# EAGLE design Automatic Changeover (EAGLE 9.6.2)
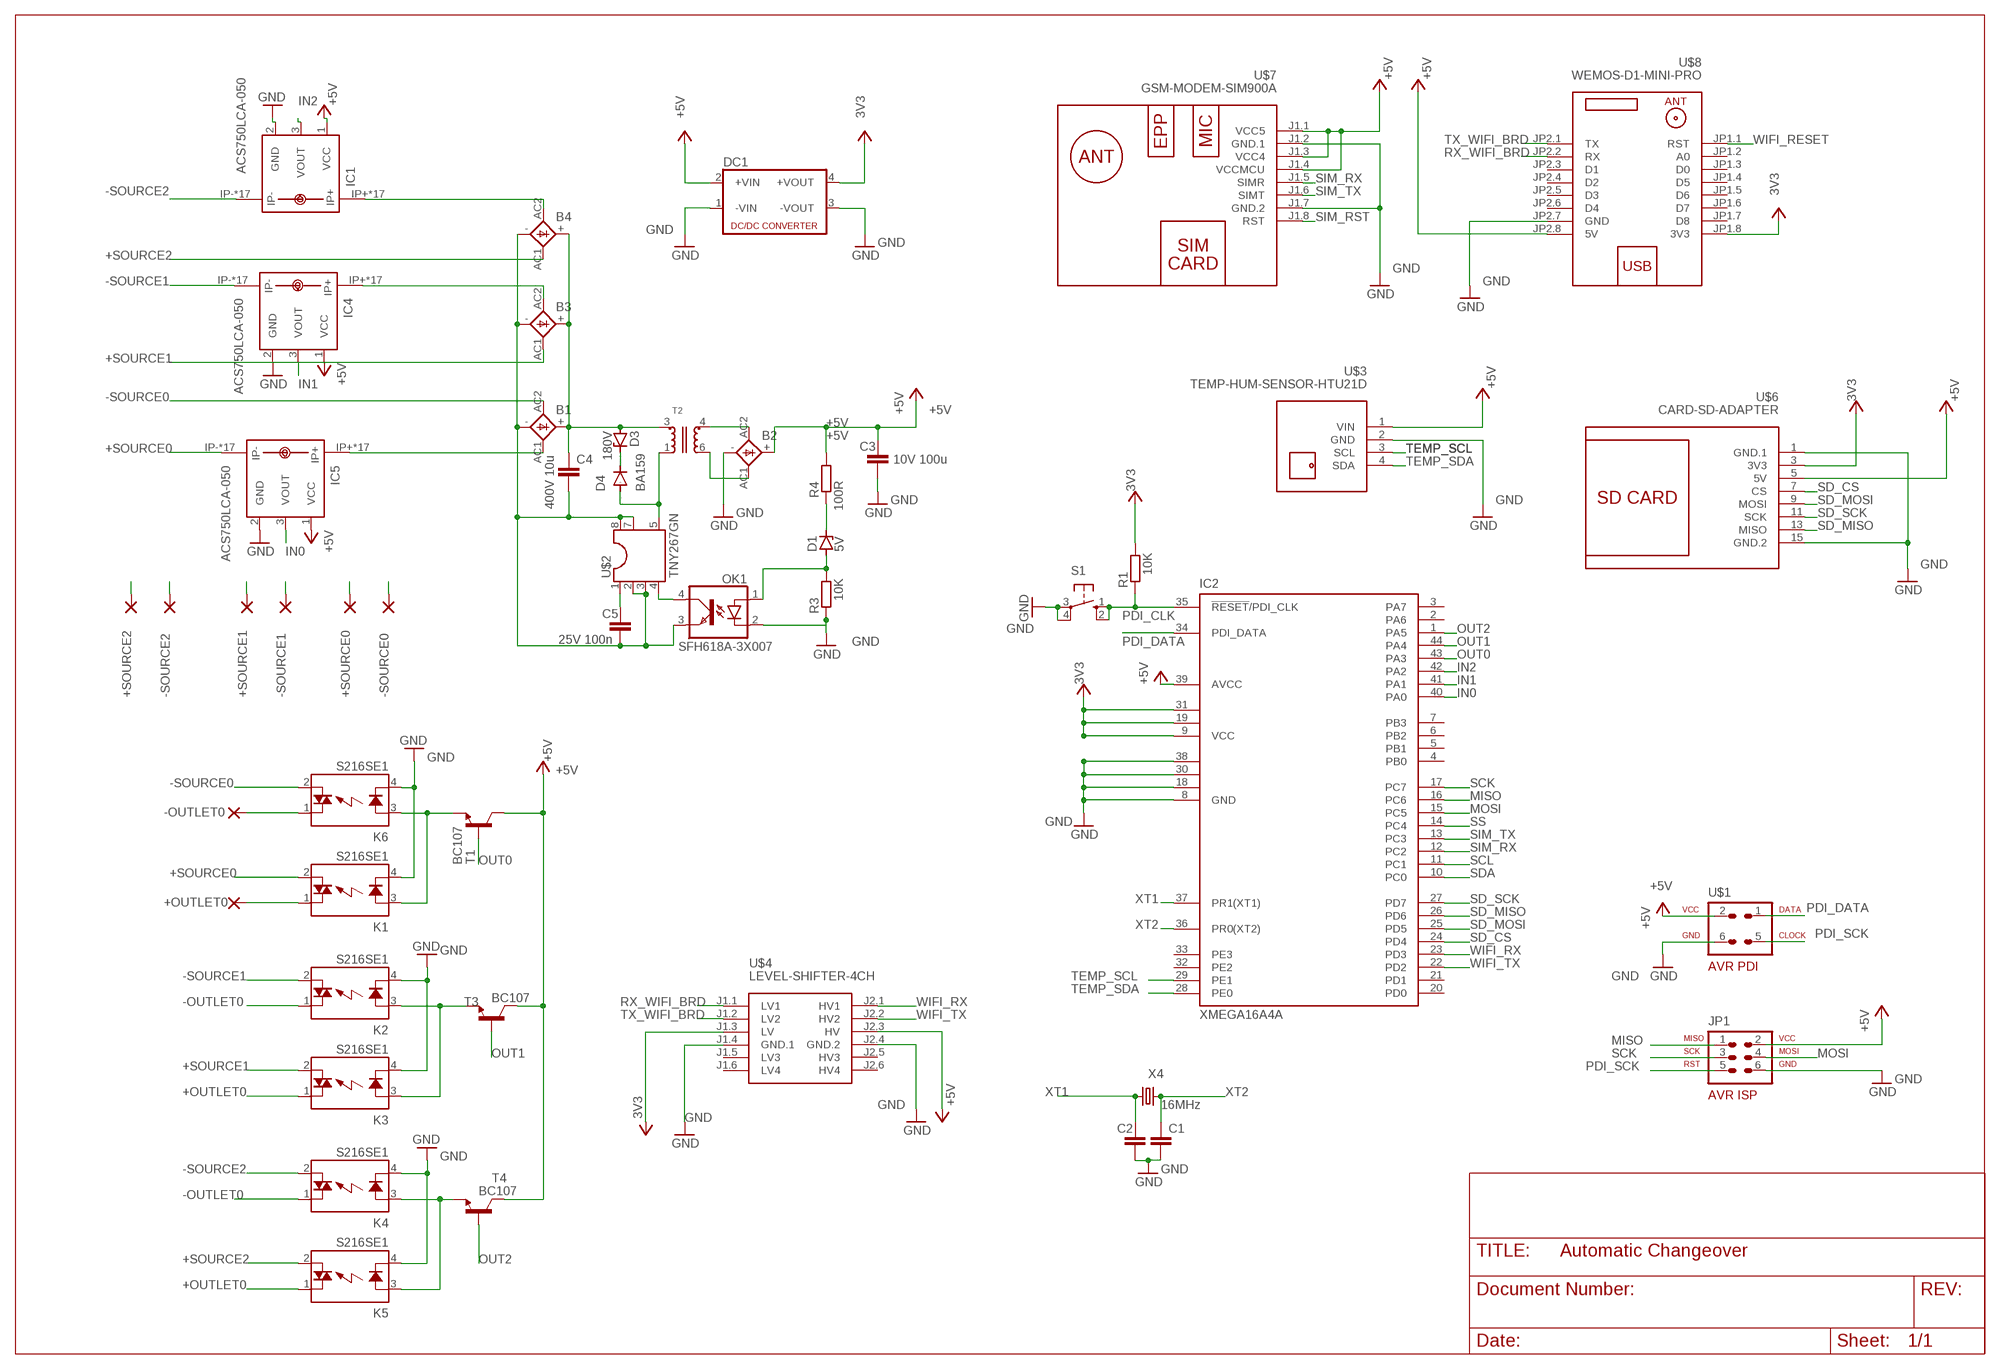
[diagram p0: schematic, sheet 1]

## Parts
+OUTLET0  3,81/1,4  [3,81/1,4]
+SOURCE0  3,81/1,4  [3,81/1,4]
+SOURCE1  3,81/1,4  [3,81/1,4]
+SOURCE2  3,81/1,4  [3,81/1,4]
-OUTLET0  3,81/1,4  [3,81/1,4]
-SOURCE0  3,81/1,4  [3,81/1,4]
-SOURCE1  3,81/1,4  [3,81/1,4]
-SOURCE2  3,81/1,4  [3,81/1,4]
B1  KBL  [KBL]
B2  KBL  [KBL]
B3  KBL  [KBL]
B4  KBL  [KBL]
C1  C-EU025-025X050  [C025-025X050]
C2  C-EU025-025X050  [C025-025X050]
C3  10V 100u  C2.5/2  [C2.5-2]
C4  400V 10u  C2.5/2  [C2.5-2]
C5  25V 100n  C2.5/2  [C2.5-2]
D1  5V  ZENER-DIODEP1-Z12  [P1Z12]
D3  180V  ZENER-DIODEP1-Z12  [P1Z12]
D4  BA159  1N4004  [DO41-10]
DC1  NME  [NME]
IC1  ACS750LCA-050  [ACS75050]
IC2  XMEGA16A4A  [TQFP44]
IC4  ACS750LCA-050  [ACS75050]
IC5  ACS750LCA-050  [ACS75050]
JP1  AVR-ISP-6VERT  [AVR-ISP-6]
K1  S216SE1  [S2XXEX]
K2  S216SE1  [S2XXEX]
K3  S216SE1  [S2XXEX]
K4  S216SE1  [S2XXEX]
K5  S216SE1  [S2XXEX]
K6  S216SE1  [S2XXEX]
OK1  SFH618A-3X007  [SMD4-7]
R1  10K  R-EU_R0805  [R0805]
R3  10K  R-EU_R0805  [R0805]
R4  100R  R-EU_R0805  [R0805]
S1  10-XX  [B3F-10XX]
T1  BC107  [TO18]
T2  WE-UNIT_74911810X  [WE_E13/7/4_THT_VERTIKAL_6PIN]
T3  BC107  [TO18]
T4  BC107  [TO18]
U$1  AVR-PDIVERT  [AVR-ISP-6]
U$2  TNY267GN  [SMD-8B]
U$3  TEMP-HUM-SENSOR-HTU21D  [TEMP-HUM-SENSOR-HTU21D]
U$4  LEVEL-SHIFTER-4CH  [LEVEL-SHIFTER-4CH]
U$6  CARD-SD-ADAPTER  [CARD-SD-ADAPTER]
U$7  GSM-MODEM-SIM900A  [GSM-MODEM-SIM900A]
U$8  WEMOS-D1-MINI-PRO  [WEMOS-D1-MINI-PRO]
X4  16MHz  CRYSTALS-NOGND-HC49/4H  [HC49]

## Nets
3V3: DC1.4(+VOUT) R1.2 U$6.3(3V3) U$8.JP1.8(3V3)
+5V: B2.+ C3.1 DC1.2(+VIN) IC1.1(VCC) IC2.39(AVCC) IC4.1(VCC) IC5.1(VCC) JP1.2 R4.2 T1.3(C) T3.3(C) T4.3(C) U$1.2 U$3.1(VIN) U$4.J2.3(HV) U$6.5(5V) U$7.J1.1(VCC5) U$7.J1.3(VCC4) U$7.J1.4(VCCMCU) U$8.JP2.8(5V)
+OUTLET0: K3.1(DS1) K5.1(DS1)
+SOURCE0: +SOURCE0.1(P) IC5.IP- IC5.IP-@2(IP-) IC5.IP-@3(IP-) IC5.IP-@4(IP-) IC5.IP-@5(IP-) IC5.IP-@6(IP-) IC5.IP-@7(IP-) IC5.IP-@8(IP-) IC5.IP-@9(IP-) IC5.IP-@10(IP-) IC5.IP-@11(IP-) IC5.IP-@12(IP-) IC5.IP-@13(IP-) IC5.IP-@14(IP-) IC5.IP-@15(IP-) IC5.IP-@16(IP-) IC5.IP-@17(IP-) K1.2(DS2)
+SOURCE1: +SOURCE1.1(P) B3.AC1(AC2) K3.2(DS2)
+SOURCE2: +SOURCE2.1(P) B4.AC1(AC2) K5.2(DS2)
-OUTLET0: K2.1(DS1) K4.1(DS1)
-SOURCE0: -SOURCE0.1(P) B1.AC2(AC1) K6.2(DS2)
-SOURCE1: -SOURCE1.1(P) IC4.IP- IC4.IP-@2(IP-) IC4.IP-@3(IP-) IC4.IP-@4(IP-) IC4.IP-@5(IP-) IC4.IP-@6(IP-) IC4.IP-@7(IP-) IC4.IP-@8(IP-) IC4.IP-@9(IP-) IC4.IP-@10(IP-) IC4.IP-@11(IP-) IC4.IP-@12(IP-) IC4.IP-@13(IP-) IC4.IP-@14(IP-) IC4.IP-@15(IP-) IC4.IP-@16(IP-) IC4.IP-@17(IP-) K2.2(DS2)
-SOURCE2: -SOURCE2.1(P) IC1.IP- IC1.IP-@2(IP-) IC1.IP-@3(IP-) IC1.IP-@4(IP-) IC1.IP-@5(IP-) IC1.IP-@6(IP-) IC1.IP-@7(IP-) IC1.IP-@8(IP-) IC1.IP-@9(IP-) IC1.IP-@10(IP-) IC1.IP-@11(IP-) IC1.IP-@12(IP-) IC1.IP-@13(IP-) IC1.IP-@14(IP-) IC1.IP-@15(IP-) IC1.IP-@16(IP-) IC1.IP-@17(IP-) K4.2(DS2)
GND: B2.- C1.2 C2.2 C3.2 DC1.1(-VIN) DC1.3(-VOUT) IC1.2(GND) IC2.8(GND) IC2.18(GND1) IC2.30(GND2) IC2.38(GND3) IC4.2(GND) IC5.2(GND) JP1.6 K1.4(K) K2.4(K) K3.4(K) K4.4(K) K5.4(K) K6.4(K) OK1.2(C) R3.1 S1.3(P) S1.4(P1) U$1.6 U$3.2(GND) U$4.J1.4(GND.1) U$4.J2.4(GND.2) U$6.1(GND.1) U$6.15(GND.2) U$7.J1.2(GND.1) U$7.J1.7(GND.2) U$8.JP2.7(GND)
IN0: IC2.40(PA0) IC5.3(VOUT)
IN1: IC2.41(PA1) IC4.3(VOUT)
IN2: IC1.3(VOUT) IC2.42(PA2)
MISO: IC2.16(PC6) JP1.1
MOSI: IC2.15(PC5) JP1.4
N$14: B4.AC2(AC1) IC1.IP+ IC1.IP+@2(IP+) IC1.IP+@3(IP+) IC1.IP+@4(IP+) IC1.IP+@5(IP+) IC1.IP+@6(IP+) IC1.IP+@7(IP+) IC1.IP+@8(IP+) IC1.IP+@9(IP+) IC1.IP+@10(IP+) IC1.IP+@11(IP+) IC1.IP+@12(IP+) IC1.IP+@13(IP+) IC1.IP+@14(IP+) IC1.IP+@15(IP+) IC1.IP+@16(IP+) IC1.IP+@17(IP+)
N$16: B1.AC1(AC2) IC5.IP+ IC5.IP+@2(IP+) IC5.IP+@3(IP+) IC5.IP+@4(IP+) IC5.IP+@5(IP+) IC5.IP+@6(IP+) IC5.IP+@7(IP+) IC5.IP+@8(IP+) IC5.IP+@9(IP+) IC5.IP+@10(IP+) IC5.IP+@11(IP+) IC5.IP+@12(IP+) IC5.IP+@13(IP+) IC5.IP+@14(IP+) IC5.IP+@15(IP+) IC5.IP+@16(IP+) IC5.IP+@17(IP+)
N$17: B1.+ B3.+ B4.+ C4.1 D3.A T2.3
N$20: B3.AC2(AC1) IC4.IP+ IC4.IP+@2(IP+) IC4.IP+@3(IP+) IC4.IP+@4(IP+) IC4.IP+@5(IP+) IC4.IP+@6(IP+) IC4.IP+@7(IP+) IC4.IP+@8(IP+) IC4.IP+@9(IP+) IC4.IP+@10(IP+) IC4.IP+@11(IP+) IC4.IP+@12(IP+) IC4.IP+@13(IP+) IC4.IP+@14(IP+) IC4.IP+@15(IP+) IC4.IP+@16(IP+) IC4.IP+@17(IP+)
N$32: -OUTLET0.1(P) K6.1(DS1)
N$36: D4.A T2.1 U$2.5(D)
N$38: B2.AC1(AC2) T2.6
N$39: D1.C R4.1
N$40: D1.A OK1.1(A) R3.2
N$41: B1.- B3.- B4.- C4.2 C5.2 OK1.3(EMIT) U$2.2(2GND) U$2.3(3GND) U$2.7(7HV-GND) U$2.8(8HV-GND)
N$42: B2.AC2(AC1) T2.4
N$43: D3.C D4.C
N$44: C5.1 U$2.1(BP)
N$45: OK1.4(COL) U$2.4(EN/UV)
N$47: +OUTLET0.1(P) K1.1(DS1)
N$58: K1.3(A) K6.3(A) T1.1(E)
N$61: K2.3(A) K3.3(A) T3.1(E)
N$63: K4.3(A) K5.3(A) T4.1(E)
OUT0: IC2.43(PA3) T1.2(B)
OUT1: IC2.44(PA4) T3.2(B)
OUT2: IC2.1(PA5) T4.2(B)
PDI_CLK: IC2.35(!RESET!/PDI_CLK) R1.1 S1.1(S) S1.2(S1)
PDI_DATA: IC2.34(PDI_DATA) U$1.1
PDI_SCK: JP1.5 U$1.5
RX_WIFI_BRD: U$4.J1.1(LV1) U$8.JP2.2(RX)
SCK: IC2.17(PC7) JP1.3
SCL: IC2.11(PC1)
SD_CS: IC2.24(PD4) U$6.7(CS)
SD_MISO: IC2.26(PD6) U$6.13(MISO)
SD_MOSI: IC2.25(PD5) U$6.9(MOSI)
SD_SCK: IC2.27(PD7) U$6.11(SCK)
SDA: IC2.10(PC0)
SIM_RST: U$7.J1.8(RST)
SIM_RX: IC2.12(PC2) U$7.J1.5(SIMR)
SIM_TX: IC2.13(PC3) U$7.J1.6(SIMT)
SS: IC2.14(PC4)
TEMP_SCL: IC2.29(PE1) U$3.3(SCL)
TEMP_SDA: IC2.28(PE0) U$3.4(SDA)
TX_WIFI_BRD: U$4.J1.2(LV2) U$8.JP2.1(TX)
VCC: IC2.9(VCC) IC2.19(VCC1) IC2.31(VCC2) U$4.J1.3(LV) ; supply symbol labelled 3V3
WIFI_RESET: U$8.JP1.1(RST)
WIFI_RX: IC2.23(PD3) U$4.J2.1(HV1)
WIFI_TX: IC2.22(PD2) U$4.J2.2(HV2)
XT1: C2.1 IC2.37(PR1(XT1)) X4.1
XT2: C1.1 IC2.36(PR0(XT2)) X4.2
Unconnected: IC2.2(PA6) IC2.3(PA7) IC2.4(PB0) IC2.5(PB1) IC2.6(PB2) IC2.7(PB3) IC2.20(PD0) IC2.21(PD1) IC2.32(PE2) IC2.33(PE3) U$4.J1.5(LV3) U$4.J1.6(LV4) U$4.J2.5(HV3) U$4.J2.6(HV4) U$8.JP1.2(A0) U$8.JP1.3(D0) U$8.JP1.4(D5) U$8.JP1.5(D6) U$8.JP1.6(D7) U$8.JP1.7(D8) U$8.JP2.3(D1) U$8.JP2.4(D2) U$8.JP2.5(D3) U$8.JP2.6(D4)

## Library data of the parts
+OUTLET0 +SOURCE0 +SOURCE1 +SOURCE2 -OUTLET0 -SOURCE0 -SOURCE1 -SOURCE2 = wirepad:3,81/1,4: THROUGH-HOLE PAD
B1-B4 = rectifier:KBL: DIOTEC RECTIFIER
C1 C2 = rcl:C-EU: CAPACITOR, European symbol; SPICEPREFIX: C
C3-C5 = capacitor-wima:C: CAPACITOR naming: grid - package width
D1 D3 = diode:ZENER-DIODE: Z-Diode
D4 = diode:1N4004: DIODE general purpose rectifier, 1 A
DC1 = dc-dc-converter:NME: DC-DC CONVERTER; MF: C & D TECHNOLOGIES, INC; MPN: NME1205D; OC_FARNELL: 1021466; OC_NEWARK: 98B8198
IC1 IC4 IC5 = allegro:ACS750*CA-050: Current Sensor display layer 49 Reference in BRD and place VIAs on circles Source: www.allegromicro.com/datafile/0750-050.pdf; MF: ALLEGRO MICROSYSTEMS, INC.; MPN: ACS750LCA-050; OC_FARNELL: 1457176; OC_NEWARK: 61H4464
IC2 = atmel:XMEGA16A4: MICROCONTROLLER Features High-performance, Low-power 8/16-bit AVR XMEGA Microcontroller Non-Volatile Program and Data Memories - 16 KB - 128 KB of In-System Self-Programmable Flash - 4 KB - 8 KB Boot Code Section with Independent Lock Bits - 1 KB - 2 KB EEPROM - 2 KB - 8 KB Internal SRAM Peripheral Features - Four-channel DMA Controller with support for external requests - Eight-channel Event System - Five 16-bit Timer/Counters Three Timer/Counters with 4 Output Compare or Input Capture channels Two Timer/Counters with 2 Output Compare or Input Capture channels High-Resolution Extensions on all Timer/Counters Advanced Waveform Extension on one Timer/Counter - Five USARTs IrDA Extension on one USART - Two Two-Wire Interfaces with dual address match (I2C and SMBus compatible) - Two SPIs (Serial Peripheral Interfaces) peripherals - AES and DES Crypto Engine - 16-bit Real Time Counter with Separate Oscillator - One Twelve-channel, 12-bit, 2 Msps Analog to Digital Converter - One Two-channel, 12-bit, 1 Msps Digital to Analog Converter - Two Analog Comparators with Window compare function - External Interrupts on all General Purpose I/O pins - Programmable Watchdog Timer with Separate On-chip Ultra Low Power Oscillator Special Microcontroller Features - Power-on Reset and Programmable Brown-out Detection - Internal and External Clock Options with PLL - Programmable Multi-level Interrupt Controller - Sleep Modes: Idle, Power-down, Standby, Power-save, Extended Standby - Advanced Programming, Test and Debugging Interfaces PDI (Program and Debug Interface) for programming, test and debugging I/O and Packages - 34 Programmable I/O Lines - 44 - lead TQFP - 44 - pad VQFN/QFN - 49 - ball VFBGA Operating Voltage - 1.6 - 3.6V Speed performance - 0 - 12 MHz @ 1.6 - 3.6V - 0 - 32 MHz @ 2.7 - 3.6V Drawn by Dipl.-Ing. (FH) Robert Siegler Created: 27.05.09; OC_FARNELL: unknown; OC_NEWARK: unknown
JP1 = avr-7:AVR-ISP-6: AVR ISP-6 Serial Programming Header
K1-K6 = relay:S2*: SIP Type SSR for Medium Power Control SHARP Source: 168149-da-01-en-Solid_State_Relais_S_202_SE1_SE2.pdf; OC_FARNELL: unknown; OC_NEWARK: unknown
OK1 = optocoupler:SFH618?*: Optocoupler, Phototransistor Output, Low Input Current Source: Data sheet <http://www.vishay.com/docs/83673/sfh618.pdf>; OC_FARNELL: unknown; OC_NEWARK: unknown
R1 R3 R4 = rcl:R-EU_: RESISTOR, European symbol; SPICEPREFIX: R
S1 = switch-omron:10-XX: OMRON SWITCH; MPN: B3F-1000; OC_FARNELL: 176432; OC_NEWARK: 36M3542
T1 T3 T4 = transistor:BC107: NPN TRANSISTOR
T2 = Wurth_Elektronik_Passive_rev16b:WE-UNIT_74911810X: WE-UNIT Off-Line Transformer Characteristics Nominal input voltage: 125–375 VDC (85–265 VAC) Output power 3 W and 9 W Operating temperature: –40 °C to +125 °C Clearance and creepage distance 6 mm min. Insulation test voltage: 4 kVAC, 1 Minute Design compliant to EN 61558-2-16: reinforced insulation; except 749 118 10 xx: Basic insulation Applications Designed for Tiny Switch ICs from Power Integration and NCP101x or 105x of ON Semiconductor For SMPS with universal input from 85 VAC up to 265 VAC <http://katalog.we-online.de/media/images/eisos/UtUNIT_MID_pf2.jpg> Details see: http://katalog.we-online.de/en/pbs/WE-UNIT?m Updated by Dan Xu 2014-07-11 2014 (C) Wurth Elektronik
U$1 = avr-7:AVR-PDI: AVR PDI programming interface connector
U$2 = tny26x_27x:TNY267GN
U$3 = diy-modules:TEMP-HUM-SENSOR-HTU21D: Digital Humidity & Temperature Sensor based on HTU21D device More information about HTU21D device is available here: http://futureeverything.org/wp-content/uploads/2014/05/Humidity-Datasheet.pdf HTU21D Arudino Library is available here: https://learn.sparkfun.com/tutorials/htu21d-humidity-sensor-hookup-guide/htu21d-library-and-functions Click here to find device on ebay.com <http://www.ebay.com/sch/htu21d+board>
U$4 = diy-modules:LEVEL-SHIFTER-4CH: 4-Channel Bi-Directional Logic Level Converter based on BSS128 transistors Click here to find device on ebay.com <http://www.ebay.com/sch/i2c+logic+converter+module>
U$6 = diy-modules:CARD-SD-ADAPTER: Full Size SD Card Adapter Module with onboard 3.3V regulator Guide describing how to use SD card with Arduino is available here: https://www.arduino.cc/en/Reference/SDCardNotes Click here to find device on ebay.com <http://www.ebay.com/sch/sd+card+socket+module>
U$7 = diy-modules:GSM-MODEM-SIM900A: GSM Mini Module based on SIM900A Schematic available here: http://www.electrodragon.com/w/SIM900_(SIM900A)_Mini_DEV_Board
U$8 = diy-modules:WEMOS-D1-MINI-PRO: WEMOS D1 mini Pro: Mini Wi-Fi Board based on ESP-8266EX chip More details can be found here: https://www.wemos.cc/product/d1-mini-pro.html Click here to find device on ebay.com <http://www.ebay.com/sch/wemos+d1+mini+pro>
X4 = IQD-Frequency-Products:CRYSTALS-NOGND: CRYSTALS CAN NOT GROUNDED

## Net classes
0 default: width 0.203 mm, drill 0.203 mm, clearance 0.152 mm

## Board
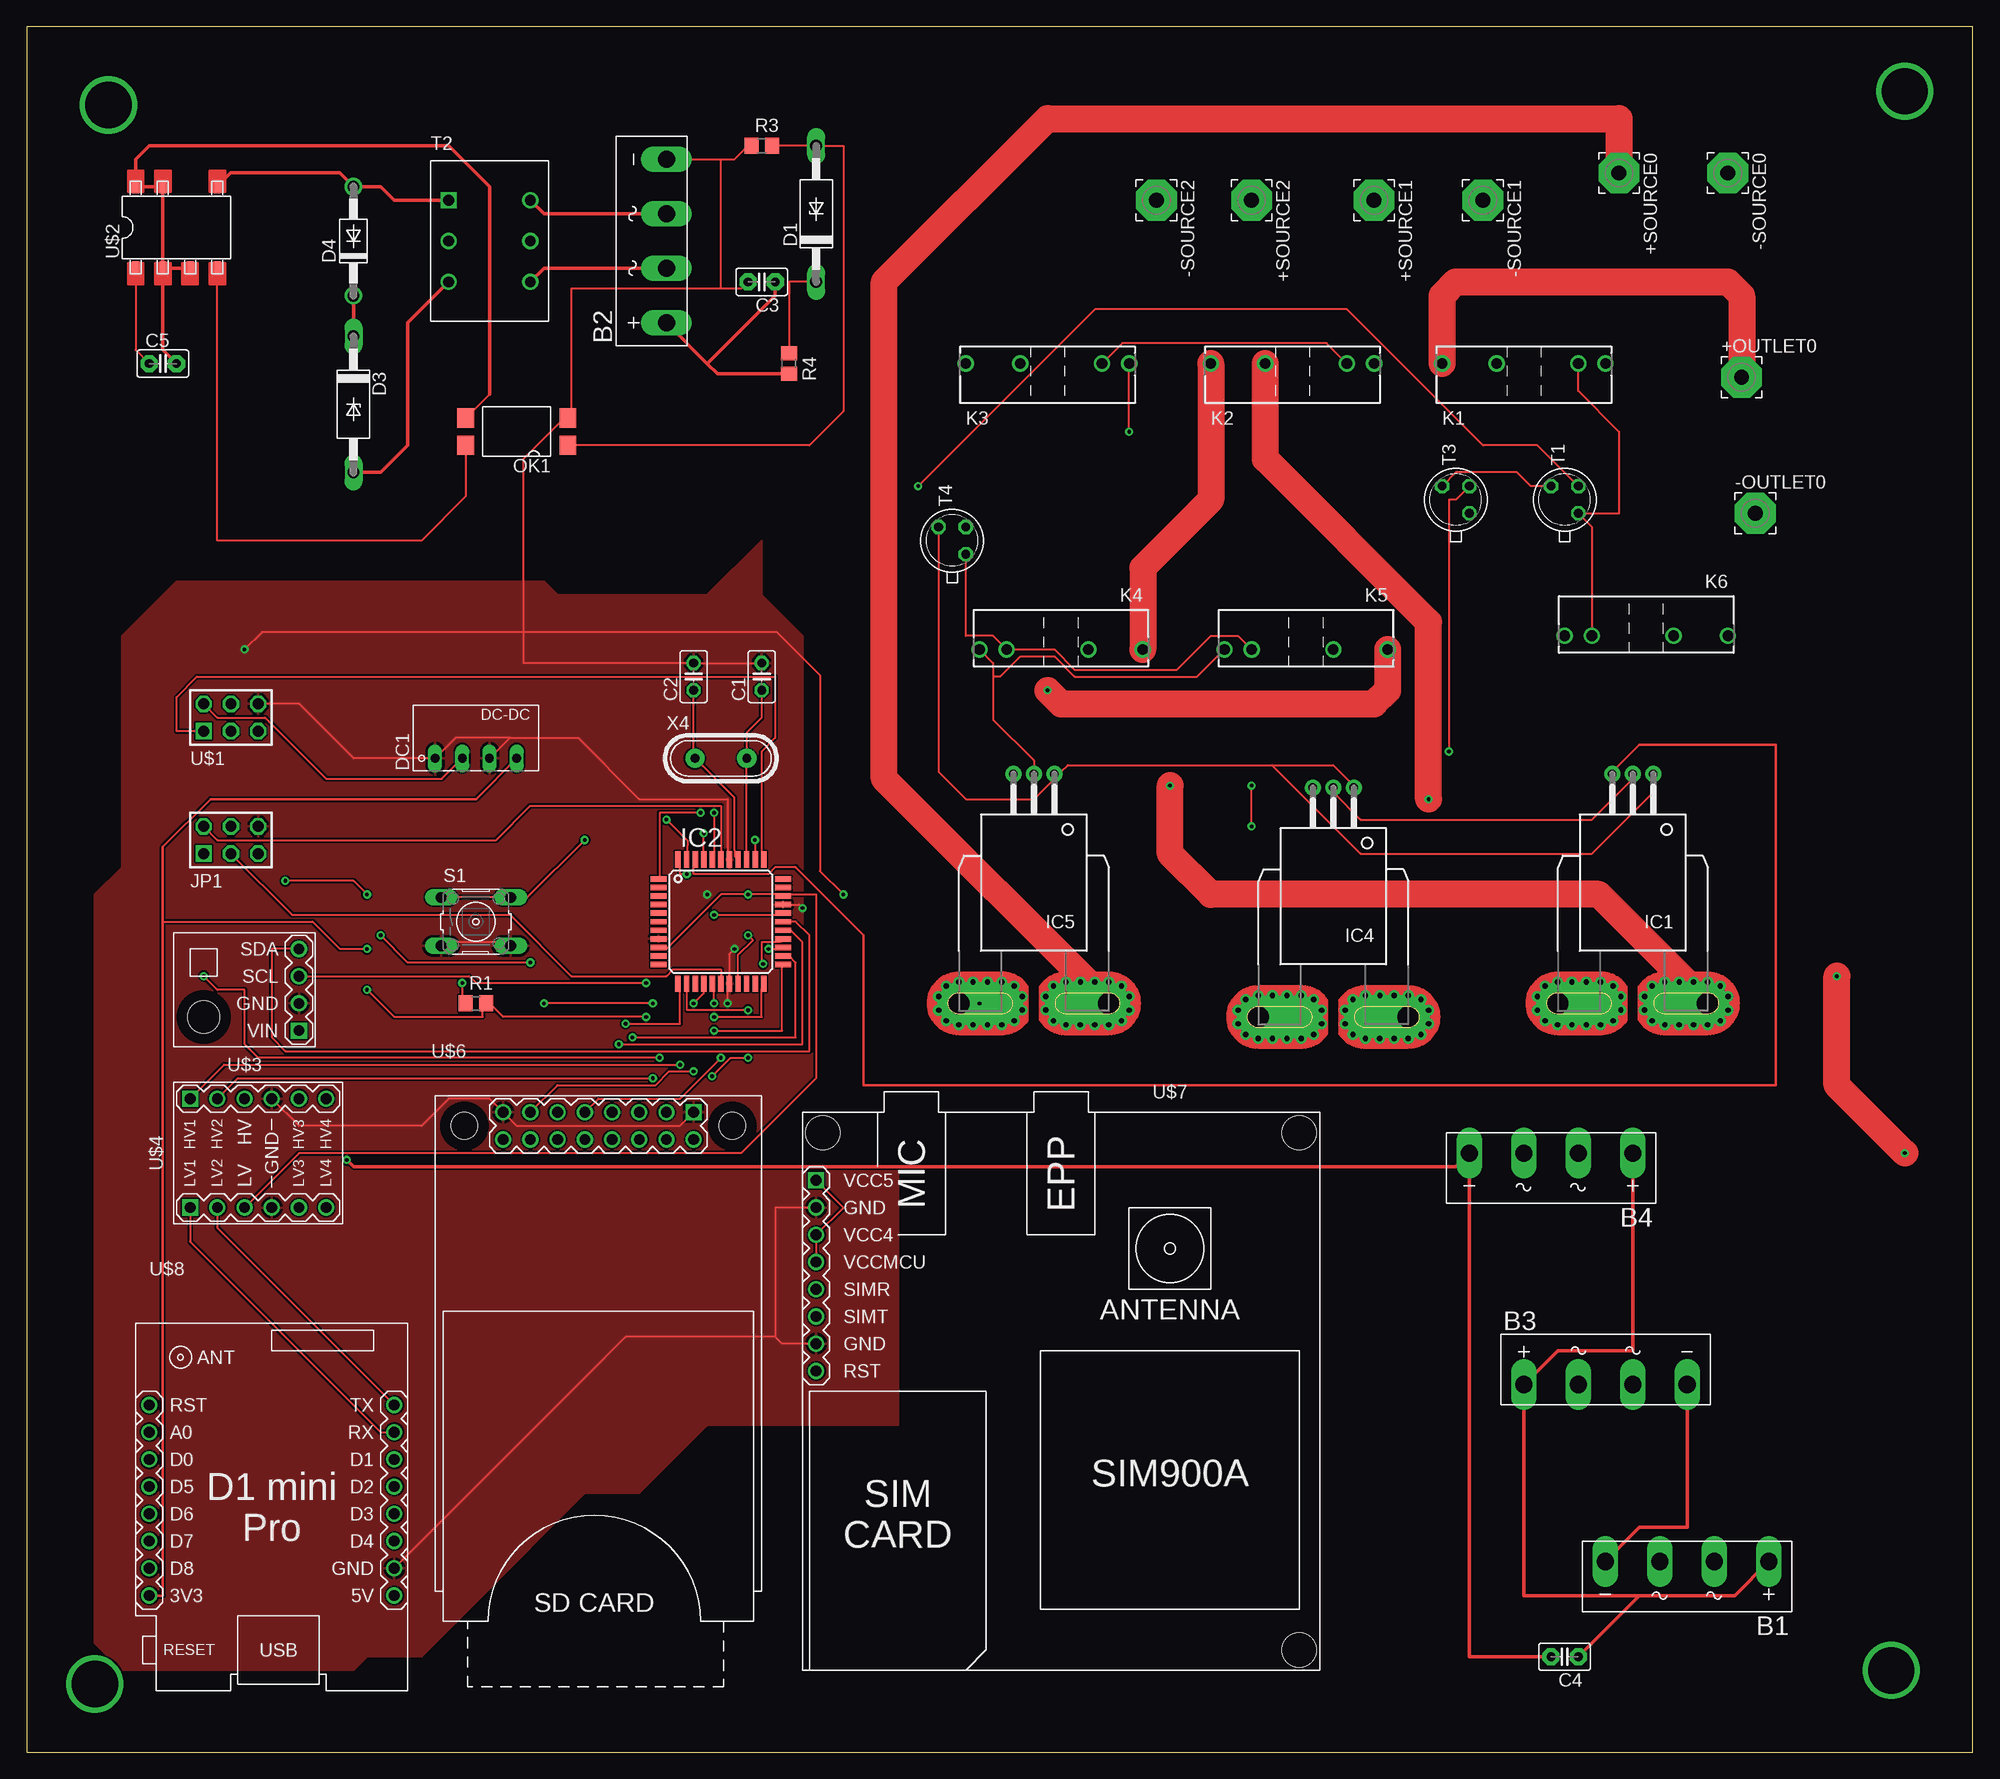
[diagram p1: board, top side]
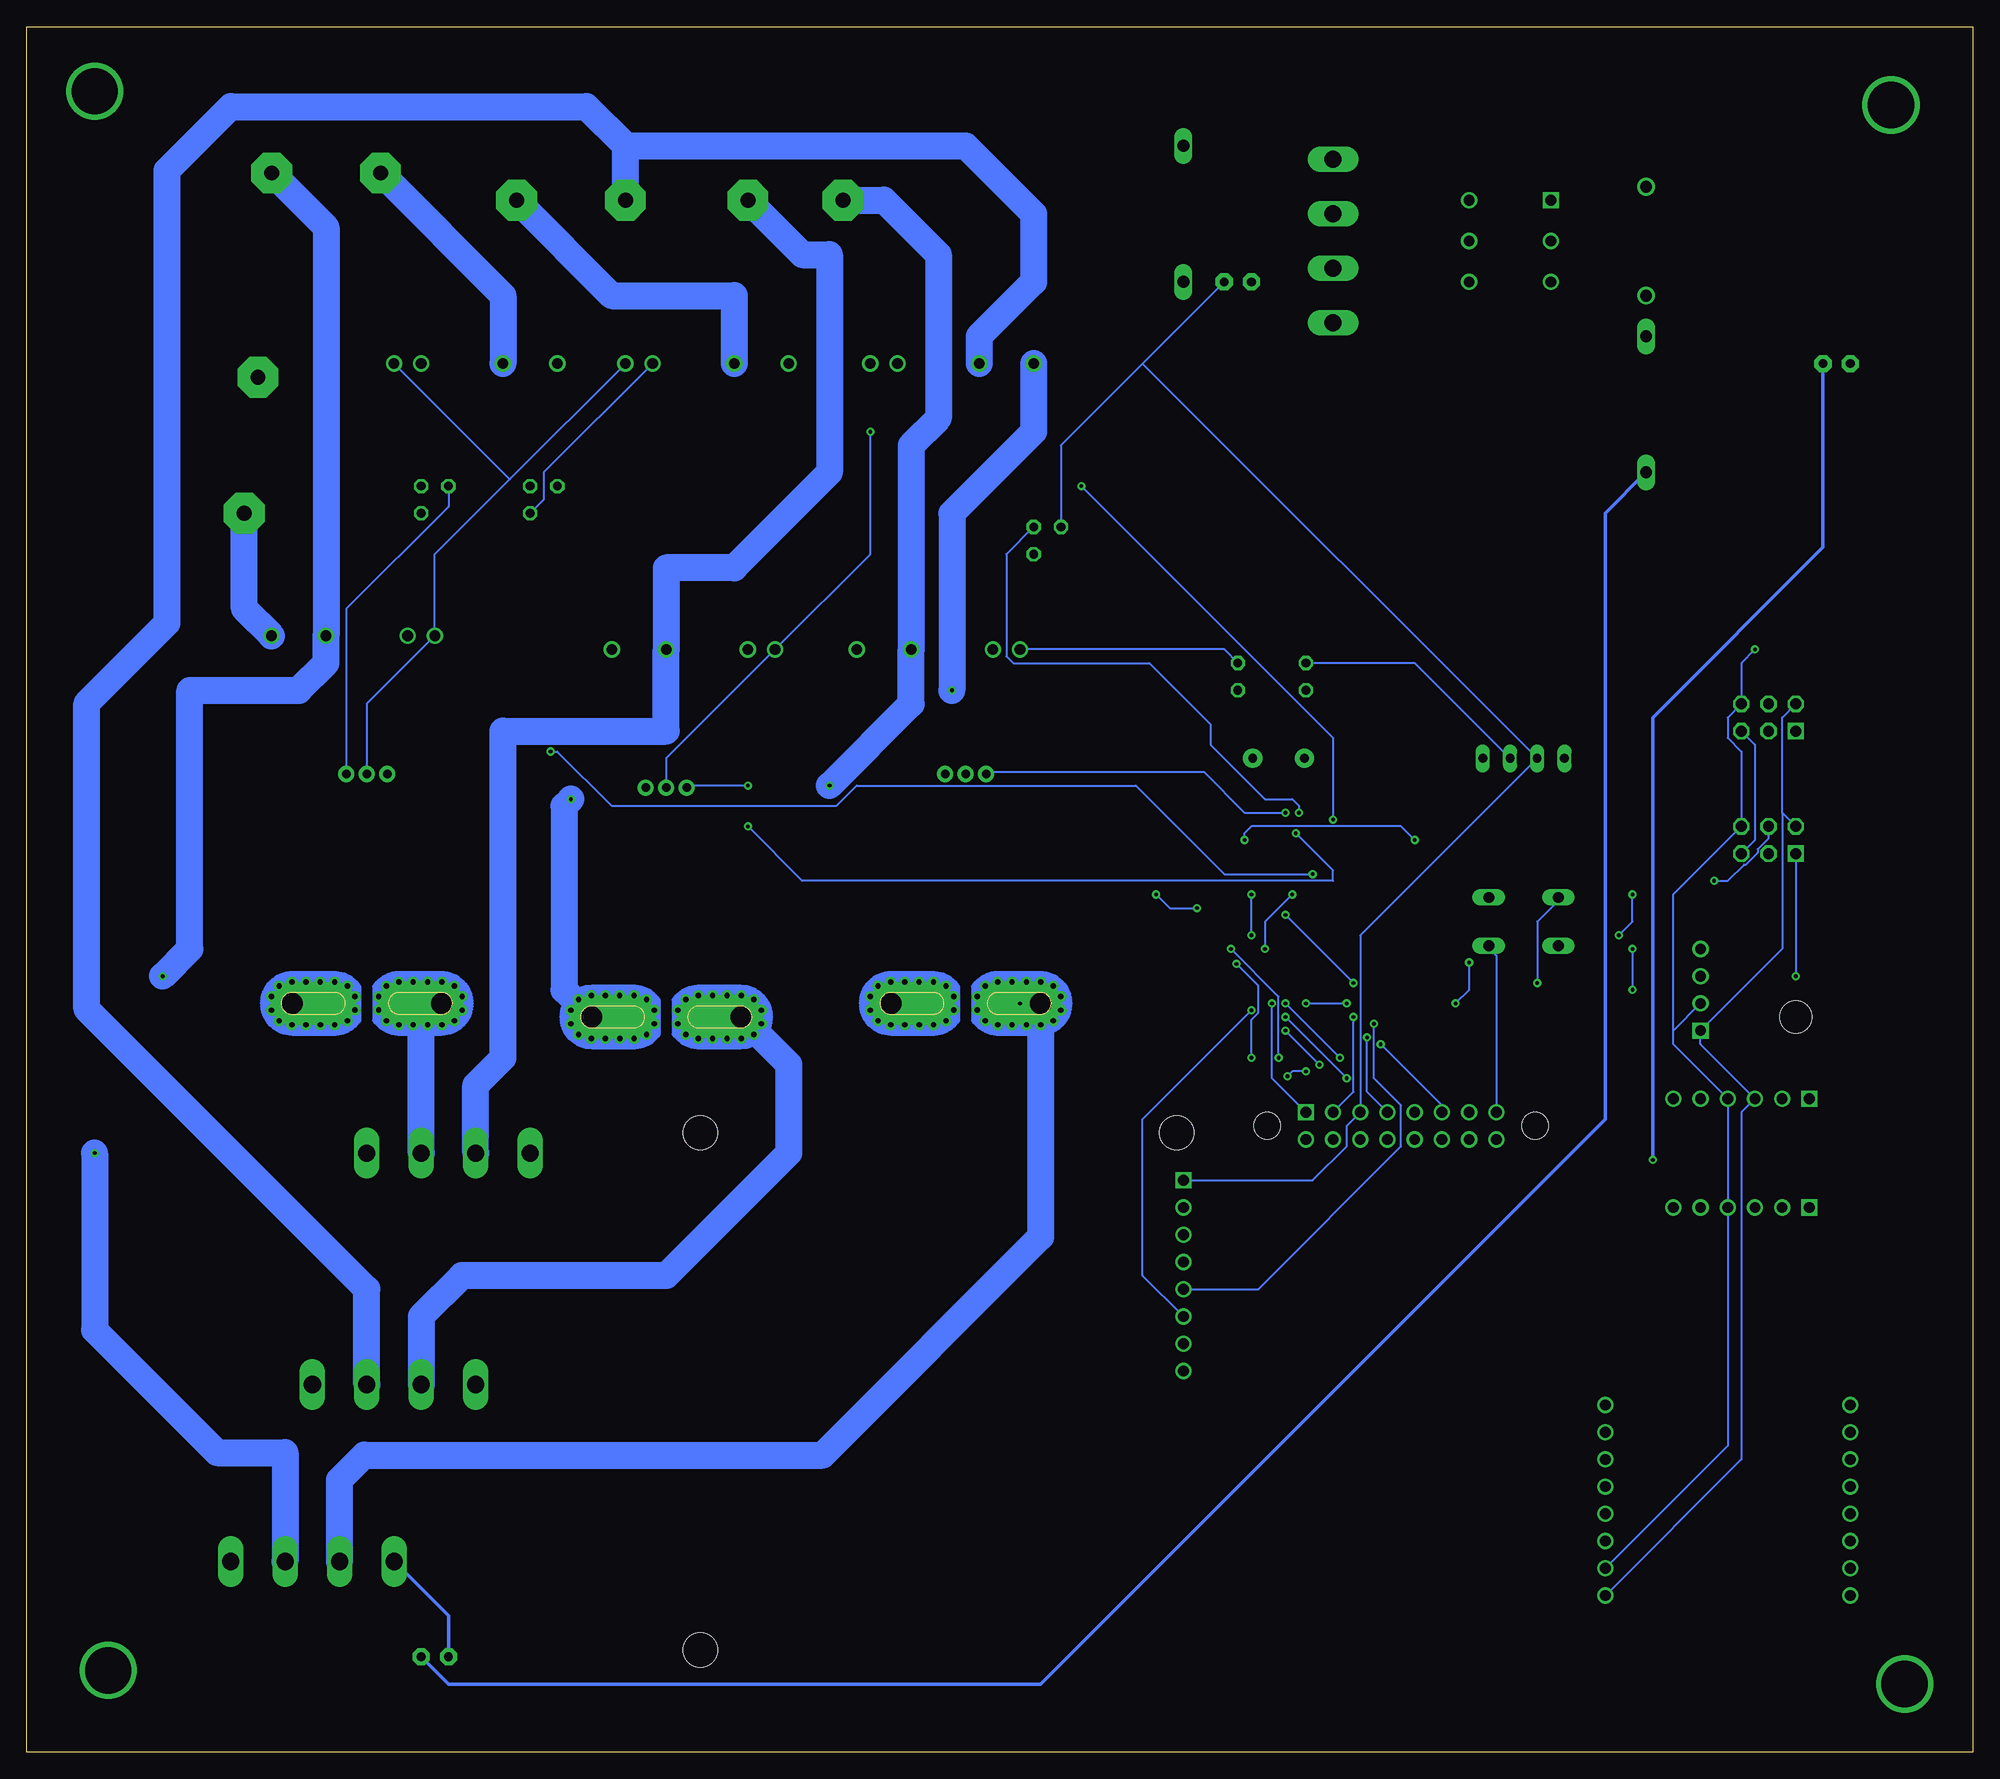
[diagram p2: board, bottom side, seen from below]

Size 181.59 x 160.96 mm. Coordinates in mm from the lower left corner, seen from the top.
Outline: 0,0 181.59,0 181.59,160.96 0,160.96 0,0
Copper layers (1*16): Top 0.035mm / dielectric 1.5mm / Bottom 0.035mm
Design rules "default *": minimum track width 6mil, minimum drill 0.35mm, track to track 6mil, track to pad 6mil, pad to pad 6mil, via to via 6mil, smd to smd 6mil, copper to edge 40mil, drill to drill 6mil, minimum pad ring 10mil, minimum via ring 8mil, stop-mask expansion 4mil, vias tented up to drill 0mil, thermal gap 10mil

### Footprints (pad centres in the part's own frame; a part is rotated, then mirrored left to right if it is on the bottom)
3,81/1,4 = drill 1.397 pad 3.81 octagon: 1 0,0
KBL = drill 1.6 long: + -7.62,-1.27; - 7.62,-1.27; AC1 2.54,-1.27; AC2 -2.54,-1.27
C025-025X050 = drill 0.813 octagon: 1 -1.27,0; 2 1.27,0
C2.5-2 = drill 0.813 pad 1.6 octagon: 1 -1.27,0; 2 1.27,0
P1Z12 = drill 1.118 long: A 6.35,0; C -6.35,0
DO41-10 = drill 1.118: A 5.08,0; C -5.08,0
NME = drill 0.813 long: 1 0,3.81; 2 0,1.27; 3 0,-1.27; 4 0,-3.81
ACS75050 = drill 0.8 pad 1.5: 1 -1.91,-21.4; 2 0,-21.4; 3 1.91,-21.4 | drill 2 pad 4 offset: IP+ 7,0; IP- -7,0 | drill 0.5 pad 0.9: IP+@2 8.89,-0.635; IP+@3 8.89,0.635; IP+@4 8.175,1.625; IP+@5 7,2; IP+@6 5.675,2; IP+@7 4.325,2; IP+@8 3,2; IP+@9 1.825,1.625; IP+@10 1.1,0.625; IP+@11 1.1,-0.625; IP+@12 1.825,-1.625; IP+@13 3,-2; IP+@14 4.325,-2; IP+@15 5.675,-2; IP+@16 7,-2; IP+@17 8.175,-1.625; IP-@2 -8.89,-0.635; IP-@3 -8.89,0.635; IP-@4 -8.175,1.625; IP-@5 -7,2; IP-@6 -5.675,2; IP-@7 -4.325,2; IP-@8 -3,2; IP-@9 -1.825,1.625; IP-@10 -1.1,0.625; IP-@11 -1.1,-0.625; IP-@12 -1.825,-1.625; IP-@13 -3,-2; IP-@14 -4.35,-2; IP-@15 -5.675,-2; IP-@16 -7,-2; IP-@17 -8.175,-1.625
TQFP44 = smd 1.5 x 0.5: 1 -5.8,4; 2 -5.8,3.2; 3 -5.8,2.4; 4 -5.8,1.6; 5 -5.8,0.8; 6 -5.8,0; 7 -5.8,-0.8; 8 -5.8,-1.6; 9 -5.8,-2.4; 10 -5.8,-3.2; 11 -5.8,-4; 23 5.8,-4; 24 5.8,-3.2; 25 5.8,-2.4; 26 5.8,-1.6; 27 5.8,-0.8; 28 5.8,0; 29 5.8,0.8; 30 5.8,1.6; 31 5.8,2.4; 32 5.8,3.2; 33 5.8,4 | smd 0.5 x 1.5: 12 -4,-5.8; 13 -3.2,-5.8; 14 -2.4,-5.8; 15 -1.6,-5.8; 16 -0.8,-5.8; 17 0,-5.8; 18 0.8,-5.8; 19 1.6,-5.8; 20 2.4,-5.8; 21 3.2,-5.8; 22 4,-5.8; 34 4,5.8; 35 3.2,5.8; 36 2.4,5.8; 37 1.6,5.8; 38 0.8,5.8; 39 0,5.8; 40 -0.8,5.8; 41 -1.6,5.8; 42 -2.4,5.8; 43 -3.2,5.8; 44 -4,5.8
AVR-ISP-6 = drill 1.016 square: 1 -2.54,-1.27 | drill 1.016 octagon: 2 -2.54,1.27; 3 0,-1.27; 4 0,1.27; 5 2.54,-1.27; 6 2.54,1.27
S2XXEX = drill 1: 1 -7.62,0; 2 -2.54,0; 3 5.08,0; 4 7.62,0
SMD4-7 = smd 1.78 x 1.55: 1 -1.27,-4.77; 2 1.27,-4.77; 3 1.27,4.77; 4 -1.27,4.77
R0805 = smd 1.3 x 1.5: 1 -0.95,0; 2 0.95,0
B3F-10XX = drill 1.016 long: 1 -3.251,2.261; 2 3.251,2.261; 3 -3.251,-2.261; 4 3.251,-2.261
TO18 = drill 0.813 octagon: 1 -1.27,-1.27; 2 1.27,-1.27; 3 1.27,1.27
WE_E13/7/4_THT_VERTIKAL_6PIN = drill 1 square: 1 -3.81,-3.81 | drill 1: 2 0,-3.81; 3 3.81,-3.81; 4 3.81,3.81; 5 0,3.81; 6 -3.81,3.81
SMD-8B = smd 0.635 x 1.27: 1 -3.81,-3.81; 2 -1.27,-3.81; 3 1.27,-3.81; 4 3.81,-3.81; 5 3.81,3.81; 7 -1.27,3.81; 8 -3.81,3.81
TEMP-HUM-SENSOR-HTU21D = drill 1 square: 1 -5.08,3.81 | drill 1: 2 -5.08,1.27; 3 -5.08,-1.27; 4 -5.08,-3.81 | hole 3: 3.81,2.54
LEVEL-SHIFTER-4CH = drill 1 square: J1.1 -5.08,6.35; J2.1 5.08,6.35 | drill 1: J1.2 -5.08,3.81; J1.3 -5.08,1.27; J1.4 -5.08,-1.27; J1.5 -5.08,-3.81; J1.6 -5.08,-6.35; J2.2 5.08,3.81; J2.3 5.08,1.27; J2.4 5.08,-1.27; J2.5 5.08,-3.81; J2.6 5.08,-6.35
CARD-SD-ADAPTER = drill 1 square: 1 -21.59,8.89 | drill 1: 2 -19.05,8.89; 3 -21.59,6.35; 4 -19.05,6.35; 5 -21.59,3.81; 6 -19.05,3.81; 7 -21.59,1.27; 8 -19.05,1.27; 9 -21.59,-1.27; 10 -19.05,-1.27; 11 -21.59,-3.81; 12 -19.05,-3.81; 13 -21.59,-6.35; 14 -19.05,-6.35; 15 -21.59,-8.89; 16 -19.05,-8.89 | hole 2.5: -20.32,12.5; -20.32,-12.5
GSM-MODEM-SIM900A = drill 1 square: J1.1 -22.86,20.32 | drill 1: J1.2 -22.86,17.78; J1.3 -22.86,15.24; J1.4 -22.86,12.7; J1.5 -22.86,10.16; J1.6 -22.86,7.62; J1.7 -22.86,5.08; J1.8 -22.86,2.54 | hole 3.2: -22.225,24.765; 22.225,24.765; 22.225,-23.495
WEMOS-D1-MINI-PRO = drill 1: JP1.1 -11.43,9.525; JP1.2 -11.43,6.985; JP1.3 -11.43,4.445; JP1.4 -11.43,1.905; JP1.5 -11.43,-0.635; JP1.6 -11.43,-3.175; JP1.7 -11.43,-5.715; JP1.8 -11.43,-8.255; JP2.1 11.43,9.525; JP2.2 11.43,6.985; JP2.3 11.43,4.445; JP2.4 11.43,1.905; JP2.5 11.43,-0.635; JP2.6 11.43,-3.175; JP2.7 11.43,-5.715; JP2.8 11.43,-8.255
HC49 = drill 0.813 pad 1.8: 1 -2.413,0; 2 2.413,0

### Placement (x,y rotation side)
+OUTLET0  160.02,128.27 0 top
+SOURCE0  148.59,147.32 270 top
+SOURCE1  125.73,144.78 270 top
+SOURCE2  114.3,144.78 270 top
-OUTLET0  161.29,115.57 0 top
-SOURCE0  158.75,147.32 270 top
-SOURCE1  135.89,144.78 270 top
-SOURCE2  105.41,144.78 270 top
B1  154.94,16.51 180 top
B2  58.42,140.97 90 top
B3  147.32,35.56 0 top
B4  142.24,54.61 180 top
C1  68.58,100.33 90 top
C2  62.23,100.33 90 top
C3  68.58,137.16 180 top
C4  143.51,8.89 180 top
C5  12.7,129.54 0 top
D1  73.66,143.51 90 top
D3  30.48,125.73 270 top
D4  30.48,140.97 90 top
DC1  41.91,92.71 90 top
IC1  149.86,69.85 180 top
IC2  64.77,77.47 0 top
IC4  121.92,68.58 180 top
IC5  93.98,69.85 180 top
JP1  19.05,85.09 0 top
K1  139.7,129.54 0 top
K2  118.11,129.54 0 top
K3  95.25,129.54 0 top
K4  96.52,102.87 180 top
K5  119.38,102.87 180 top
K6  151.13,104.14 180 top
OK1  45.72,123.19 90 top
R1  41.91,69.85 0 top
R3  68.58,149.86 0 top
R4  71.12,129.54 270 top
S1  41.91,77.47 0 top
T1  143.51,116.84 90 top
T2  43.18,140.97 270 top
T3  133.35,116.84 90 top
T4  86.36,113.03 90 top
U$1  19.05,96.52 0 top
U$2  13.97,142.24 0 top
U$3  20.32,71.12 180 top
U$4  21.59,55.88 90 top
U$6  53.34,38.1 270 top
U$7  96.52,33.02 0 top
U$8  22.86,22.86 0 top
X4  64.77,92.71 0 top

### Tracks (layer width: path | path; a pad name or v marks a point on that pad's centre or on a via)
3V3  (via drill 0.35)
  Top 0.203: v57.78,68.58 44.45,68.58 43.18,69.85 R1.2 42.54,69.85 42.54,68.58 34.29,68.58 v31.75,71.12 | v31.75,74.93 29.21,74.93 26.67,77.47 12.7,77.47
  Top 0.254: DC1.4 41.91,88.9 17.14,88.9 12.7,84.45 12.7,77.47 12.7,14.61 U$8.JP1.8
  Bottom 0.203: v57.78,68.58 57.78,61.59 U$6.3 | v31.75,74.93 v31.75,71.12
+5V
  Top 0.203: U$7.J1.4 U$7.J1.3 76.2,50.8 U$7.J1.1 | DC1.2 38.73,90.81 27.94,90.81 22.23,96.52 17.78,96.52 U$1.2 | IC2.39 64.77,88.27 46.99,88.27 43.81,85.09 17.78,85.09 JP1.2 | T3.3 133.35,119.38 139.06,119.38 140.34,118.11 T1.3 | 116.2,92.08 97.16,92.08 96.52,91.44 IC5.1 95.89,90.81 93.98,88.9 87.63,88.9 85.09,91.44 T4.3 | 116.2,92.08 121.92,92.08 123.83,90.17 IC4.1 | 116.2,92.08 124.46,83.82 146.05,83.82 151.75,89.52 IC1.1
  Top 0.305: R4.2 69.53,128.59 64.45,128.59 63.5,129.54 | B2.+ 63.5,129.54 | C3.1 69.85,135.89 63.5,129.54
  Bottom 0.203: U$8.JP2.8 21.59,27.3 21.59,59.69 U$4.J2.3 25.4,66.04 U$3.1 17.78,74.93 17.78,87.63 | U$7.J1.1 61.59,53.34 58.42,56.52 58.42,58.42 U$6.5 57.15,76.2 DC1.2 77.47,129.54 | U$1.2 17.78,96.52 17.78,87.63 | JP1.2 17.78,87.63 | T1.3 142.24,116.2 151.77,106.68 151.77,91.44 IC1.1 | T4.3 85.09,121.92 77.47,129.54 | C3.1 77.47,129.54
+OUTLET0  (via drill 0.35)
  Top 2.54: v95.25,99.06 96.52,97.79 125.73,97.79 127,99.06 K5.1
  Bottom 2.54: K3.1 87.63,123.19 95.25,115.57 v95.25,99.06
+SOURCE0
  Top 2.54: IC5.IP- 80.01,90.82 80.01,137.16 95.25,152.4 148.59,152.4 +SOURCE0.1
  Bottom 2.54: +SOURCE0.1 137.16,135.89 K1.2
+SOURCE1
  Bottom 2.54: +SOURCE1.1 125.73,149.86 | 125.73,149.86 93.98,149.86 87.63,143.51 87.63,137.16 92.71,132.08 K3.2 | B3.AC1 149.86,43.18 175.99,69.31 175.99,97.85 168.5,105.34 168.5,147.57 162.56,153.52 129.39,153.52 125.73,149.86
+SOURCE2
  Bottom 2.54: +SOURCE2.1 109.22,139.7 106.68,139.7 106.68,119.38 115.57,110.49 121.92,110.49 K5.2 121.92,95.25 137.16,95.25 137.16,64.77 139.7,62.23 B4.AC1
-OUTLET0
  Top 2.54: K2.1 110.49,116.84 104.14,110.49 K4.1
-SOURCE0  (via drill 0.35)
  Top 2.54: v175.26,55.88 168.91,62.23 v168.91,72.39
  Bottom 2.54: -SOURCE0.1 153.67,142.24 K6.2 153.67,101.6 156.21,99.06 166.37,99.06 166.37,74.93 v168.91,72.39 | v175.26,55.88 175.26,39.37 163.83,27.94 157.48,27.94 B1.AC2
-SOURCE1  (via drill 0.35)
  Top 2.54: v130.81,88.9 130.81,105.41 115.57,120.65 K2.2
  Bottom 2.54: -SOURCE1.1 127,135.89 115.57,135.89 K2.2 | IC4.IP- 131.46,71.12 131.46,88.25 v130.81,88.9
-SOURCE2  (via drill 0.35)
  Top 2.54: IC1.IP- 146.7,80.01 110.49,80.01 106.68,83.82 v106.68,90.17
  Bottom 2.54: -SOURCE2.1 101.6,144.78 96.52,139.7 96.52,124.46 99.06,121.92 K4.2 99.06,97.79 v106.68,90.17
GND  (via drill 0.35)
  Top 0.203: v65.41,69.85 65.41,71.12 IC2.18 65.57,74.46 v66.04,74.93 | S1.3 38.73,75.56 45.09,75.56 S1.4 | U$6.1 60.96,58.42 45.72,58.42 U$6.15 43.18,60.96 39.37,60.96 36.83,58.42 25.4,58.42 U$4.J2.4 | 69.85,38.73 69.85,50.8 U$7.J1.2 | 69.85,38.73 55.88,38.73 U$8.JP2.7 | B2.- 64.77,148.59 | 64.77,148.59 66.04,148.59 67.31,149.86 R3.1 | 64.77,136.53 66.67,136.53 C3.2 | 64.77,136.53 50.8,136.53 50.8,124.46 OK1.2 50.16,124.46 46.35,120.65 46.35,101.6 C2.2 C1.2 | 64.77,136.53 64.77,148.59 | 90.17,100.33 90.17,101.6 K4.4 | 90.17,100.33 90.17,96.33 93.98,92.52 IC5.2 | 45.09,94.62 51.43,94.62 57.15,88.9 65.41,88.9 65.41,83.82 IC2.38 | DC1.3 45.09,94.62 | 45.09,94.62 40,94.62 DC1.1 30.48,92.71 25.4,97.79 U$1.6 | K5.4 109.22,100.33 97.79,100.33 95.89,102.23 92.71,102.23 90.81,100.33 90.17,100.33 | IC1.2 149.86,90.81 146.05,87 124.46,87 121.92,89.53 IC4.2 | v102.87,123.19 K3.4 | v76.2,80.01 74.02,82.19 74.02,100.48 70,104.5 21.95,104.5 v20.32,102.87 | IC2.30 72.06,79.07 v72.39,78.74 | 63.5,79.84 v63.5,80.01 | U$7.J1.7 70.48,38.1 69.85,38.73
  Bottom 0.203: v65.41,69.85 65.41,62.87 U$6.1 | U$6.15 44.45,74.3 45.09,74.93 S1.4 | U$8.JP2.7 22.86,28.57 U$4.J1.4 U$4.J2.4 27.94,66.04 27.94,67.31 | 27.94,67.31 U$3.2 | 27.94,67.31 27.94,80.01 JP1.6 21.59,93.34 22.86,94.62 22.86,96.52 U$1.6 21.59,101.6 v20.32,102.87 | IC1.2 149.86,97.79 K6.4 143.51,111.76 136.53,118.75 | 136.53,118.75 K2.4 | 136.53,118.75 K1.4 | IC4.2 121.92,92.71 K5.4 102.87,111.76 v102.87,123.19 | C2.2 52.07,101.6 DC1.3 | K4.4 69.85,102.87 C1.2 | v76.2,80.01 74.93,78.74 v72.39,78.74 | v63.5,80.01 66.04,77.47 v66.04,74.93
  pour Top: 68.58,113.03 68.58,107.95 72.39,104.14 72.39,71.12 81.28,62.23 81.28,39.37 81.28,30.48 63.5,30.48 57.15,24.13 52.07,24.13 41.91,13.97 36.83,8.89 31.75,8.89 30.48,7.62 13.97,7.62 8.89,7.62 6.35,10.16 6.35,29.21 6.35,80.01 8.89,82.55 8.89,104.14 13.97,109.22 27.94,109.22 48.26,109.22 49.53,107.95 63.5,107.95
IN0  (via drill 0.35)
  Top 0.203: v64.14,87.63 64.14,83.82 IC2.40
  Bottom 0.203: v64.14,87.63 67.95,87.63 71.76,91.44 91.44,91.44 IC5.3
IN1  (via drill 0.35)
  Top 0.203: v114.3,86.36 v114.3,90.17 | IC2.41 v63.17,85.73
  Bottom 0.203: v114.3,86.36 109.22,81.28 59.69,81.28 59.69,82.25 v63.17,85.73 | v114.3,90.17 119.82,90.17 IC4.3
IN2
  Top 0.203: 71.76,82.55 69.85,82.55 69.22,81.92 62.23,81.92 62.23,83.19 IC2.42 | 147.96,91.44 IC1.3
  Top 0.254: 71.76,82.55 78.11,76.2 78.11,62.23 163.19,62.23 163.19,93.98 150.5,93.98 147.96,91.44
MISO  (via drill 0.35)
  Top 0.203: v64.14,69.85 64.14,71.12 IC2.16 | v16.51,72.39 17.78,71.12 20.32,71.12 20.32,66.04 21.59,64.77 v59.05,64.77
  Bottom 0.203: v59.05,64.77 v64.14,69.85 | JP1.1 v16.51,72.39
MOSI  (via drill 0.35)
  Top 0.203: IC2.15 63.17,70.79 v62.23,69.85 | v58.42,69.85 v48.26,69.85 | v46.99,73.66 35.56,73.66 v33.02,76.2 | v31.75,80.01 30.48,81.28 v24.13,81.28
  Bottom 0.203: v62.23,69.85 v58.42,69.85 | v48.26,69.85 46.99,71.12 v46.99,73.66 | v33.02,76.2 31.75,77.47 v31.75,80.01 | v24.13,81.28 22.86,81.28 21.34,82.8 21.17,82.8 20.07,83.91 20.07,84.24 19.05,85.26 JP1.4
N$1  (via drill 4.32)
  other vias: 175.26,154.94
N$3  (via drill 4.32)
  other vias: 7.62,153.67
N$4  (via drill 4.32)
  other vias: 6.35,6.35
N$5  (via drill 4.32)
  other vias: 173.99,7.62
N$14
  Bottom 0.203: IC1.IP+ 144.15,67.95 144.78,67.95
  Bottom 2.54: B4.AC2 144.78,67.95
N$16  (via drill 0.35)
  Bottom 0.203: IC5.IP+ v88.9,69.85
  Bottom 2.54: B1.AC1 152.4,25.4 150.09,27.71 107.33,27.71 86.98,48.06 IC5.IP+
N$17
  Top 0.305: T2.3 35.56,133.35 35.56,121.92 33.02,119.38 D3.A | 150.5,14.61 C4.1 | 150.5,14.61 159.38,14.61 B1.+ | 150.5,14.61 139.7,14.61 B3.+ 142.88,37.47 149.86,37.47 B4.+
  Bottom 0.305: D3.A 34.29,115.57 34.29,59.05 87,6.35 142.24,6.35 C4.1
N$20
  Bottom 2.54: IC4.IP+ 110.49,64.15 110.49,55.88 121.92,44.45 140.97,44.45 144.78,40.64 B3.AC2
N$32
  Bottom 2.54: -OUTLET0.1 161.29,106.68 K6.1
N$36
  Top 0.305: T2.1 34.29,144.78 33.02,146.05 D4.A 29.21,147.32 19.05,147.32 U$2.5
N$38
  Top 0.305: B2.AC1 48.26,143.51 T2.6
N$39
  Top 0.203: R4.1 71.12,137.16 D1.C
N$40
  Top 0.203: R3.2 D1.A 76.2,149.86 76.2,125.09 73.03,121.92 OK1.1
N$41  (via drill 0.35)
  Top 0.203: OK1.3 43.18,126.69
  Top 0.305: C5.2 12.7,130.81 12.7,137.16 U$2.2 | B3.- 154.94,20.95 150.5,20.95 B1.- | C4.2 134.62,8.89 B4.- 133.35,54.61 30.48,54.61 v29.85,55.25 | 43.18,126.69 43.18,146.05 39.37,149.86 11.43,149.86 10.16,148.59 U$2.8 | U$2.8 12.61,146.05 12.65,146.01 | 12.65,146.01 12.7,145.94 | 12.65,146.01 | U$2.3 U$2.2 | U$2.2 12.7,145.94 | 12.7,145.94 12.65,146.01 | U$2.7 U$2.8
  Bottom 0.305: C4.2 142.24,12.7 B1.- | C5.2 13.97,112.39 29.85,96.52 v29.85,55.25
N$42
  Top 0.305: B2.AC2 48.26,138.43 T2.4
N$43
  Top 0.305: D4.C D3.C
N$44
  Top 0.203: U$2.1 10.16,130.81 C5.1
N$45
  Top 0.203: U$2.4 17.78,113.03 36.83,113.03 40.95,117.15 OK1.4
N$47
  Top 2.54: K1.1 132.08,135.89 133.35,137.16 158.75,137.16 160.02,135.89 +OUTLET0.1
N$58
  Top 0.203: K6.3 146.05,114.3 T1.1 148.59,115.57 148.59,123.19 144.78,127 K1.3
N$61
  Top 0.203: K3.3 102.23,131.44 121.29,131.44 K2.3
  Bottom 0.203: T3.1 133.35,116.84 133.35,119.38 K2.3
N$63
  Top 0.203: T4.1 87.63,104.14 90.17,104.14 K4.3 95.89,102.87 97.79,100.97 107.31,100.97 110.49,104.14 113.03,104.14 K5.3
OUT0  (via drill 0.35)
  Top 0.203: v59.69,87 61.65,85.03 IC2.43 | v83.19,118.11 99.7,134.62 123.19,134.62 135.89,121.92 140.97,121.92 T1.2
  Bottom 0.203: v59.69,87 59.69,94.62 v83.19,118.11
OUT1  (via drill 0.35)
  Top 0.203: v61.59,81.92 60.96,81.92 60.96,83.19 IC2.44 | v132.72,93.34 132.72,116.84 133.35,116.84 T3.2
  Bottom 0.203: v61.59,81.92 69.85,81.92 78.11,90.17 104.14,90.17 106.05,88.27 127,88.27 132.08,93.34 v132.72,93.34
OUT2  (via drill 0.35)
  Top 0.203: v62.86,87.63 59.05,87.63 59.05,81.28 IC2.1
  Bottom 0.203: T4.2 90.17,111.76 90.17,102.23 89.54,101.6 76.84,101.6 71.12,95.89 71.12,93.98 66.04,88.9 63.5,88.9 62.86,88.27 v62.86,87.63
PDI_CLK  (via drill 0.35)
  Top 0.203: v40.64,71.75 40.64,69.85 R1.1 | v67.95,85.09 67.95,83.82 IC2.35 | v52.07,85.09 46.71,79.73 S1.2 S1.1
  Bottom 0.203: v40.64,71.75 40.64,77.47 38.73,79.38 S1.1 | v52.07,85.09 53.34,86.36 67.31,86.36 67.95,85.73 v67.95,85.09
PDI_DATA
  Top 0.203: U$1.1 13.97,95.25 13.97,98.42 15.88,100.33 69.85,100.33 69.85,94.62 68.58,93.34 68.58,83.82 IC2.34
PDI_SCK
  Bottom 0.203: JP1.5 20.32,85.09 20.32,93.98 U$1.5
RX_WIFI_BRD
  Top 0.203: U$8.JP2.2 33.02,29.84 15.24,47.62 U$4.J1.1
SCK
  Top 0.203: IC2.17 64.77,73.03 60.32,73.03 59.69,72.39 50.8,72.39 45.09,78.11 24.77,78.11 JP1.3
SD_CS  (via drill 0.35)
  Top 0.203: v56.52,66.67 71.76,66.67 71.76,73.66 71.12,74.3 IC2.24
  Bottom 0.203: v56.52,66.67 56.52,61.59 U$6.7
SD_MISO  (via drill 0.35)
  Top 0.203: U$6.13 49.53,62.23 58.68,62.23 59.95,63.5 v62.23,63.5 | v63.95,63.05 65.66,64.77 v67.31,64.77 | IC2.26 70.27,75.57 68.58,75.57 68.58,73.53 v68.71,73.53
  Bottom 0.203: v62.23,63.5 63.5,63.5 v63.95,63.05 | v67.31,64.77 67.31,68.32 66.68,68.95 66.68,71.5 v68.71,73.53
SD_MOSI  (via drill 0.35)
  Top 0.203: v69.22,74.93 70.48,74.93 IC2.25 | v64.77,64.77 60.96,60.96 53.34,60.96 U$6.9
  Bottom 0.203: v69.22,74.93 64.77,70.48 v64.77,64.77
SD_SCK  (via drill 0.35)
  Top 0.203: v55.24,66.04 72.39,66.04 72.39,75.56 71.12,76.84 IC2.27
  Bottom 0.203: v55.24,66.04 49.53,60.33 U$6.11
SIM_RX  (via drill 0.35)
  Top 0.203: v55.88,67.95 60.96,67.95 60.96,71.12 IC2.12
  Bottom 0.203: v55.88,67.95 55.88,62.87 53.34,60.33 53.34,56.52 66.67,43.18 U$7.J1.5
SIM_TX  (via drill 0.35)
  Top 0.203: v67.31,69.22 61.59,69.22 61.59,71.12 IC2.13
  Bottom 0.203: v67.31,69.22 77.47,59.05 77.47,44.45 U$7.J1.6
TEMP_SCL  (via drill 0.35)
  Top 0.203: v64.14,78.11 70.48,78.11 IC2.29 | v57.78,71.75 41.91,71.75 41.27,72.39 U$3.3
  Bottom 0.203: v57.78,71.75 v64.14,78.11
TEMP_SDA
  Top 0.203: IC2.28 71.76,77.47 73.03,76.2 73.03,65.41 24.13,65.41 22.86,66.67 22.86,74.93 U$3.4
TX_WIFI_BRD
  Top 0.203: U$8.JP2.1 17.78,48.9 U$4.J1.2
VCC  (via drill 0.35)
  Top 0.203: IC2.9 59.05,74.93 59.69,74.93 64.77,80.01 v67.31,80.01 70.48,80.01 IC2.31 71.12,80.01 73.66,80.01 73.66,62.87 66.67,55.88 25.4,55.88 U$4.J1.3 | IC2.19 66.37,74.37 67.76,75.75 v67.31,76.2
  Bottom 0.203: v67.31,76.2 v67.31,80.01
WIFI_RX  (via drill 0.35)
  Top 0.203: v64.14,67.31 70.48,67.31 70.48,73.66 IC2.23 | v60.96,64.14 18.41,64.14 U$4.J2.1
  Bottom 0.203: v60.96,64.14 v64.14,67.31
WIFI_TX  (via drill 0.35)
  Top 0.203: v64.14,68.58 68.58,68.58 68.58,71.12 IC2.22 | v58.42,62.87 19.68,62.87 U$4.J2.2
  Bottom 0.203: v58.42,62.87 v64.14,68.58
XT1
  Top 0.203: IC2.37 66.07,83.57 66.07,84.12 66.04,84.16 66.04,89.03 X4.1 62.23,92.84 C2.1
XT2
  Top 0.203: IC2.36 67.17,92.7 | 67.17,92.7 X4.2 | C1.1 68.58,96.52 67.17,95.11 67.17,92.7